# Altium schematic sheet Therm_Comparators.SchDoc
size A4; SheetNumber: 2; SheetTotal: 6
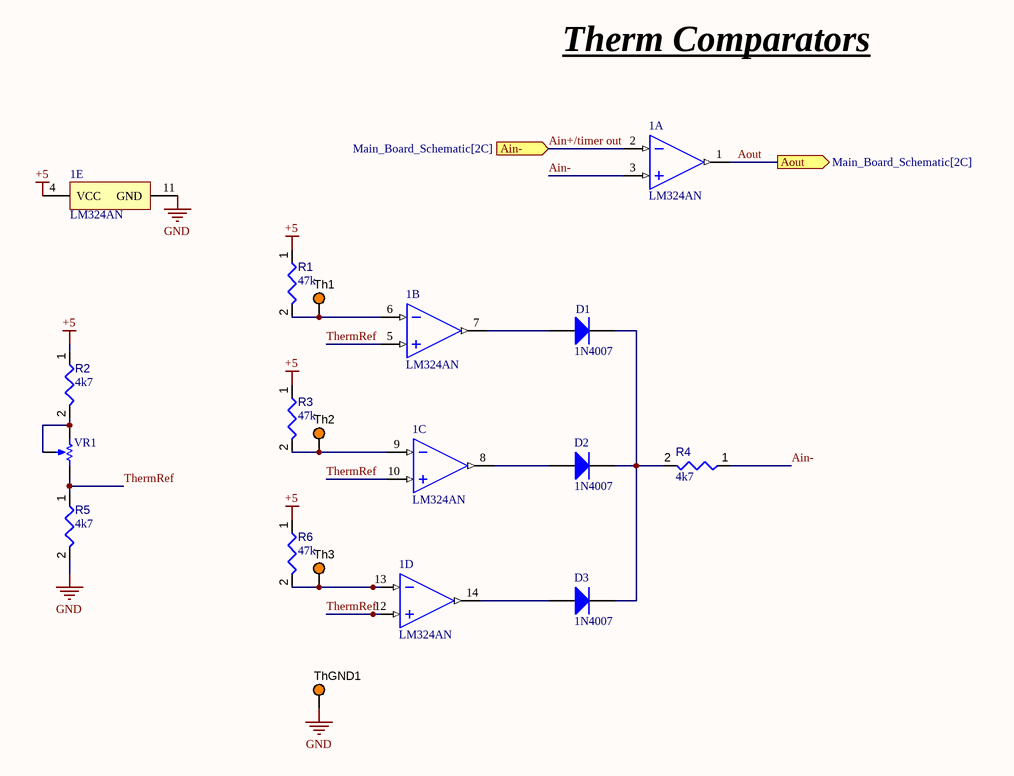
[diagram p0: Therm_Comparators.SchDoc]

## Parts
1  LM324AN  [TI-N0014A]  (parts A,B,C,D,E of 5)
D1  1N4007  [FAIR-DO-41-2]
D2  1N4007  [FAIR-DO-41-2]
D3  1N4007  [FAIR-DO-41-2]
R1  value 47k  [RESA60-630X240]  (hidden comment: MFR-25FBF52-100R)
R2  value 4k7  [RESA60-630X240]  (hidden comment: MFR-25FBF52-100R)
R3  value 47k  [RESA60-630X240]  (hidden comment: MFR-25FBF52-100R)
R4  value 4k7  [RESA60-630X240]  (hidden comment: MFR-25FBF52-100R)
R5  value 4k7  [RESA60-630X240]  (hidden comment: MFR-25FBF52-100R)
R6  value 47k  [RESA60-630X240]  (hidden comment: MFR-25FBF52-100R)
Th1  5003  [KSTN-5003]  (value not drawn)
Th2  5003  [KSTN-5003]  (value not drawn)
Th3  5003  [KSTN-5003]  (value not drawn)
ThGND1  5003  [KSTN-5003]  (value not drawn)
VR1  3362P-1-104LF  [BOUR-3362P]  (value not drawn)

## Ports
Ain- (in, see Main_Board_Schematic[2C]), Aout (out, see Main_Board_Schematic[2C])

## Nets
+5: 1.4(VCC) R1.1 R2.1 R3.1 R6.1
GND: 1.11(GND) R5.2 ThGND1.1
Ain+/timer out: 1.2(1IN-) ; port Ain-
Ain-: 1.3(1IN+) R4.1
Aout: 1.1(1OUT) ; port Aout
ThermRef: 1.5(2IN+) 1.10(3IN+) 1.12(4IN+) R5.1 VR1.3(CW)
Net1_6: 1.6(2IN-) R1.2 Th1.1
Net1_7: 1.7(2OUT) D1.2(A)
Net1_8: 1.8(3OUT) D2.2(A)
Net1_9: 1.9(3IN-) R3.2 Th2.1
Net1_13: 1.13(4IN-) R6.2 Th3.1
Net1_14: 1.14(4OUT) D3.2(A)
NetD1_1: D1.1(K) D2.1(K) D3.1(K) R4.2
NetR2_2: R2.2 VR1.1(CCW) VR1.2(S)

## Notes on the sheet
- Therm Comparators

## Library data of the parts
1 = CMP-014-00016-2: Quadruple Operational Amplifier, 1.2 MHz, 0 to 70 degC, 14-Pin PDIP (N), Pb-Free (RoHS), Tube; Manufacturer: Texas Instruments (TI); Max Dual Supply Voltage: 16V; Nominal Dual Supply Voltage: 12V; Nominal Voltage Gain: 100dB; Min Supply Voltage: 1.5V; Unity Gain Bandwidth Product: 1.2MHz; Output Current: 30mA; Nominal Supply Current: 3mA; RoHS Compliant: True; Package Reference: N-14; Min Operating Temperature: 0°C; Case/Package: DIP; Mounting Technology: TH; Package Description: 14-Pin Double In-line Package, Body 19.305 x 6.35 mm, Pitch 2.54 mm; Nominal Supply Voltage: 12V; Package URL: http://www.ti.com/lit/ml/mpdi002c/mpdi002c.pdf; Package Quantity: 25; Datasheet Version: SLOS066W, 03/2015; Manufacturer URL: http://www.ti.com/; Datasheet URL: http://www.ti.com/lit/ds/symlink/lm324a.pdf; Min Dual Supply Voltage: 1.5V; Max Supply Voltage: 16V; Pins: 14; Max Operating Temperature: 70°C
D1-D3 = CMP-004-00007-2: General Purpose Rectifier, 1.1 V, 1.0 A, -55 to 175 degC, 2-Pin DO-41, RoHS, Tape and Reel; Manufacturer: Fairchild; Peak Reverse Current: 5uA; Max Surge Current: 30A; Elements: 1; Forward Voltage: 1.1V; Package Version: Rev. 2, 09/2008; Forward Current: 1A; Package Quantity: 5000; Packaging: TapeandReel; Package URL: http://www.fairchildsemi.com/dwg/DO/DO41A.pdf; Manufacturer URL: https://www.fairchildsemi.com/; Package Reference: DO-41-2; Pins: 2; Min Operating Temperature: -55°C; Datasheet Version: Rev. 1.1.0, 11/2014; Max Operating Temperature: 175°C; RoHS Compliant: True; Case/Package: DO-41-2; Mounting Technology: TH; Package Description: 2-Pin Axial Lead, Dia 2.375 mm, Body Length 4.63 mm; Datasheet URL: https://www.fairchildsemi.com/datasheets/1N/1N4007.pdf
R1-R6 = CMP-009-00046-4: Axial Resistor, 100 Ohm, +/- 1%, 0.25 W, -55 to 155 degC, 2-Pin THD, RoHS, Bulk; Manufacturer: Yageo; Voltage Rating: 250V; Power: 250mW; Packaging: Bulk; Max Operating Temperature: 155°C; Mounting Technology: TH; Datasheet Version: Apr-13; Case/Package: Axial; RoHS Compliant: True; Package Description: 2-Pin Axial Lead, Dia 2.4 mm, Body Length 6.3 mm; Package Quantity: 200; Package Reference: MFR-25; Tolerance: 1%; Composition: CarbonFilm; Datasheet URL: http://www.yageo.com/documents/recent/Yageo%20LR_MFR_2013.pdf; Manufacturer URL: http://www.yageo.com/; Min Operating Temperature: -55°C
Th1-Th3 ThGND1 = CMP-002-00037-2: Test Point, Orange, Height 4.6 mm, Tail Length 3 mm, 1-Pin THD, RoHS; Manufacturer: Keystone; Colour: Orange; Packaging: Bulk; Package Description: 1-Pin Through Hole Device, Dia 2.54 mm; Pins: 1; Package Reference: 5003; Datasheet Version: Jun-15; Case/Package: 5003; Mounting Technology: TH; Connector Type: TestPoint; Diameter: 2.54mm; Contact Material: Bronze; Datasheet URL: http://keyelco.com/userAssets/file/M65p56.pdf; Manufacturer URL: http://www.keyelco.com/; Package Quantity: 10; Contact Plating: Tin; RoHS Compliant: True
VR1 = CMP-009-00040-2: Square Trimpot(R) Trimming Potentiometer, 100 KOhm, 300 V, -55 to 125 degC, 3-Pin THD, RoHS, Tube; Manufacturer: Bourns; Voltage Rating: 300V; Resistance: 100k; Power: 500mW; Tolerance: 10%; RoHS Compliant: True; Mounting Technology: TH; Datasheet URL: http://www.bourns.com/docs/Product-Datasheets/3362.pdf; Min Operating Temperature: -55°C; Composition: Potentiometer; Package Quantity: 250; Lead Pitch: 2.54mm; Case/Package: 3326P; Package Description: 3-Pin Through Hole Device, Body 6.6 x 6.99 mm, Pitch 2.54 mm; Datasheet Version: May-16; Packaging: Rail/Tube; Package Reference: 3326P; Manufacturer URL: http://www.bourns.com/; Max Operating Temperature: 125°C